# EasyEDA schematic SCH_Task 10.1.json
TITLE: PCB Design; REV: 1.0; Date: 2022-05-17; Sheet: 1/1; Company: SIT210
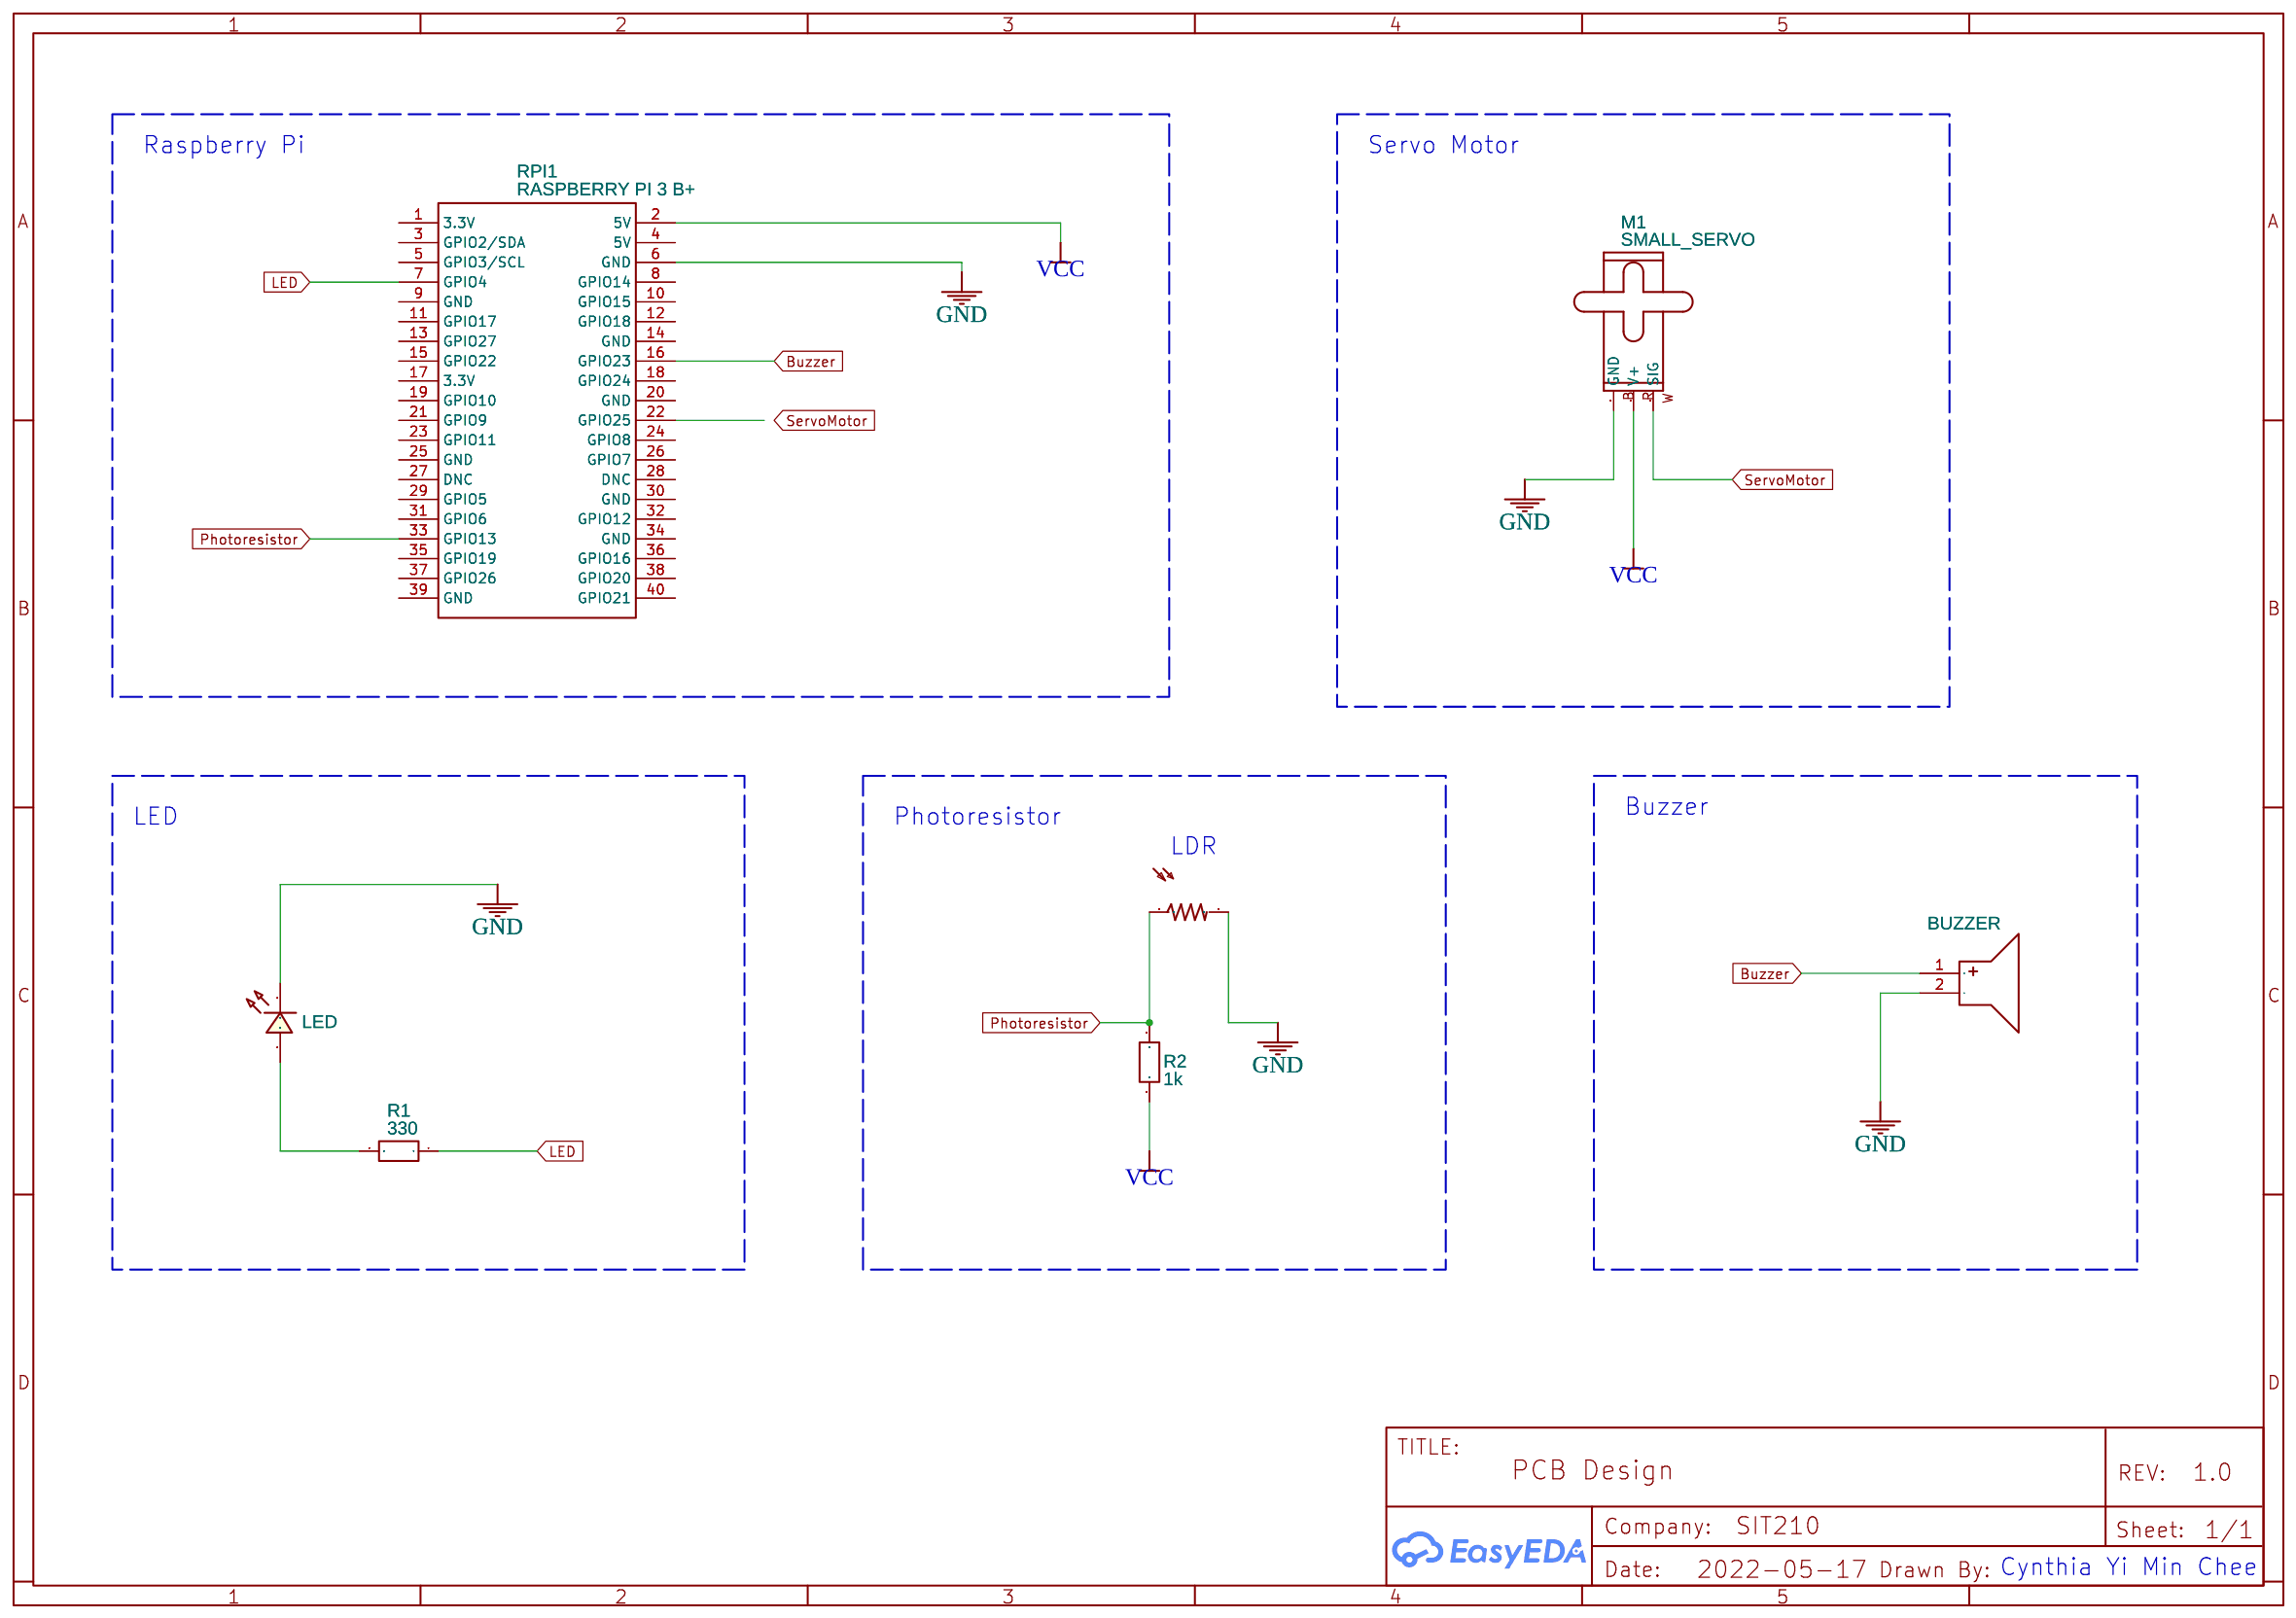
[diagram p0: schematic sheet]

## Parts
BUZZER  BUZZER.9032  [BUZ-SMD_2P-L10.5-W9.0-P10.50-R]
LDR1  LDR  [LDR1]
LED  LED-0603_R  [LED0603_RED]
M1  SMALL_SERVO  [1X03]
R1  330  [R0603]
R2  1k  [R0603]
RPI1  RASPBERRY PI 3 B+  [HDR-20X2/2.54]

## Library data of the parts
BUZZER = BUZZER.9032: Supplier: LCSC; Supplier Part: C9900002564; Contributor: LCSC; JLCPCB Part Class: Extended Part
LDR1 = LDR1: Contributor: opticals
LED = LED-0603_R: Manufacturer: EVERLIGHT(台湾亿光); Manufacturer Part: 19-217/R6C-AL1M2VY/3T; Supplier Part: C72044; Supplier: LCSC; Contributor: LCEDA_01
M1 = SMALL_SERVO: Small servo motor; Contributor: SparkFun
R1 R2 = R_0603_EU: Contributor: LCEDA_Lib
RPI1 = RASPBERRY PI 3 B+: Contributor: Sases; Supplier: Adafruit; Manufacturer: Raspberry Pi; Supplier Part: 3775; Manufacturer Part: Raspberry Pi 3 - Model B+ - 1.4GHz Cortex-A53 with 1GB RAM

## Nets
GND: BUZZER.2(-) LDR1.2 LED.2 M1.3(GND) RPI1.6(GND)
VCC: M1.2(V+) R2.1 RPI1.2(5V)
Buzzer: BUZZER.1(+) RPI1.16(GPIO23)
LED: R1.1 RPI1.7(GPIO4)
Photoresistor: LDR1.1 R2.2 RPI1.33(GPIO13)
ServoMotor: M1.1(SIG)
Net-(LED-1): LED.1 R1.2

Not connected (* = marked no-connect by the designer): RPI1 1(3.3V) 3(GPIO2/SDA) 4(5V) 5(GPIO3/SCL) 8(GPIO14) 9(GND) 10(GPIO15) 11(GPIO17) 12(GPIO18) 13(GPIO27) 14(GND) 15(GPIO22) 17(3.3V) 18(GPIO24) 19(GPIO10) 20(GND) 21(GPIO9) 22(GPIO25) 23(GPIO11) 24(GPIO8) 25(GND) 26(GPIO7) 27(DNC) 28(DNC) 29(GPIO5) 30(GND) 31(GPIO6) 32(GPIO12) 34(GND) 35(GPIO19) 36(GPIO16) 37(GPIO26) 38(GPIO20) 39(GND) 40(GPIO21)

## Notes on the sheet
- Raspberry Pi
- Servo Motor
- LED
- Photoresistor
- Buzzer
- LDR
- Cynthia Yi Min Chee
